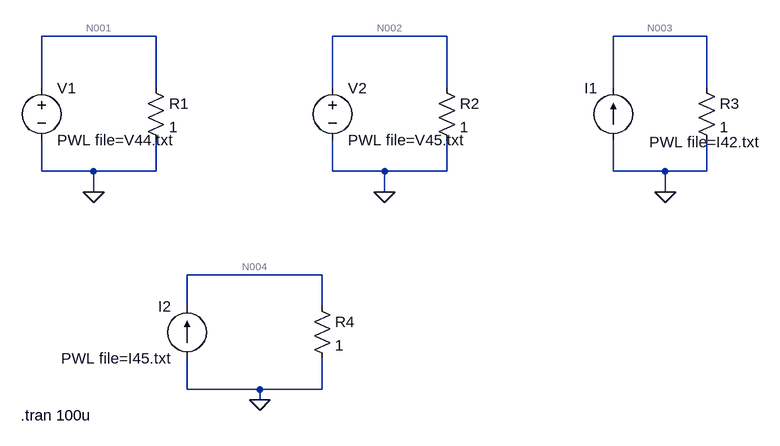
[diagram p0: schematic Estandares.asc]
Estandares.asc, the LTspice schematic file:
Version 4
SHEET 1 1316 680
WIRE 48 -224 -128 -224
WIRE 496 -224 320 -224
WIRE 896 -224 752 -224
WIRE -128 -144 -128 -224
WIRE 48 -144 48 -224
WIRE 320 -144 320 -224
WIRE 496 -144 496 -224
WIRE 752 -144 752 -224
WIRE 896 -144 896 -224
WIRE -128 -16 -128 -64
WIRE -48 -16 -128 -16
WIRE 48 -16 48 -64
WIRE 48 -16 -48 -16
WIRE 320 -16 320 -64
WIRE 400 -16 320 -16
WIRE 496 -16 496 -64
WIRE 496 -16 400 -16
WIRE 752 -16 752 -64
WIRE 832 -16 752 -16
WIRE 896 -16 896 -64
WIRE 896 -16 832 -16
WIRE -48 16 -48 -16
WIRE 400 16 400 -16
WIRE 832 16 832 -16
WIRE 304 144 96 144
WIRE 96 192 96 144
WIRE 304 192 304 144
WIRE 96 320 96 272
WIRE 208 320 96 320
WIRE 304 320 304 272
WIRE 304 320 208 320
WIRE 208 336 208 320
FLAG -48 16 0
FLAG 400 16 0
FLAG 832 16 0
FLAG 208 336 0
SYMBOL voltage 320 -160 R0
WINDOW 123 0 0 Left 0
WINDOW 39 0 0 Left 0
SYMATTR InstName V2
SYMATTR Value PWL file=V45.txt
SYMBOL res 32 -160 R0
SYMATTR InstName R1
SYMATTR Value 1
SYMBOL res 480 -160 R0
SYMATTR InstName R2
SYMATTR Value 1
SYMBOL res 880 -160 R0
SYMATTR InstName R3
SYMATTR Value 1
SYMBOL voltage -128 -160 R0
WINDOW 123 0 0 Left 0
WINDOW 39 0 0 Left 0
SYMATTR InstName V1
SYMATTR Value PWL file=V44.txt
SYMBOL current 752 -64 R180
WINDOW 0 24 80 Left 2
WINDOW 3 -225 -3 Left 2
WINDOW 123 0 0 Left 0
WINDOW 39 0 0 Left 0
SYMATTR InstName I1
SYMATTR Value PWL file=I42.txt
SYMBOL current 96 272 R180
WINDOW 0 24 80 Left 2
WINDOW 3 24 0 Left 2
WINDOW 123 0 0 Left 0
WINDOW 39 0 0 Left 0
SYMATTR InstName I2
SYMATTR Value PWL file=I45.txt
SYMBOL res 288 176 R0
SYMATTR InstName R4
SYMATTR Value 1
TEXT -160 360 Left 2 !.tran 100u

The netlist it stands for:
* Estandares.asc
V2 N002 0 PWL file=V45.txt
R1 N001 0 1
R2 N002 0 1
R3 N003 0 1
V1 N001 0 PWL file=V44.txt
I1 0 N003 PWL file=I42.txt
I2 0 N004 PWL file=I45.txt
R4 N004 0 1
.tran 100u
.backanno
.end

* Results of the author's LTspice run, read from the files saved beside the schematic
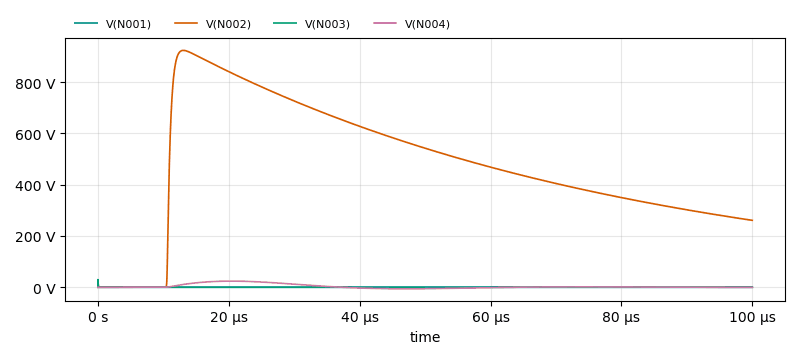
[diagram p1: Transient Analysis of Estandares.asc, plotted from the saved traces]
* Transient Analysis, 1 run:
*   V(N001): min 0 V, max 24 pV, average 23.98 pV, rms 23.98 pV, last 23.95 pV
*   V(N002): min 10.84 mV, max 923.4 V, average 476.5 V, rms 536.6 V, last 260.8 V
*   V(N003): min 0 V, max 29.73 V, average 11.12 mV, rms 359.7 mV, last 0 V
*   V(N004): min -6.047 V, max 23.88 V, average 3.107 V, rms 8.729 V, last -387.4 mV